# Altium project PCB_FINAL.PrjPcb
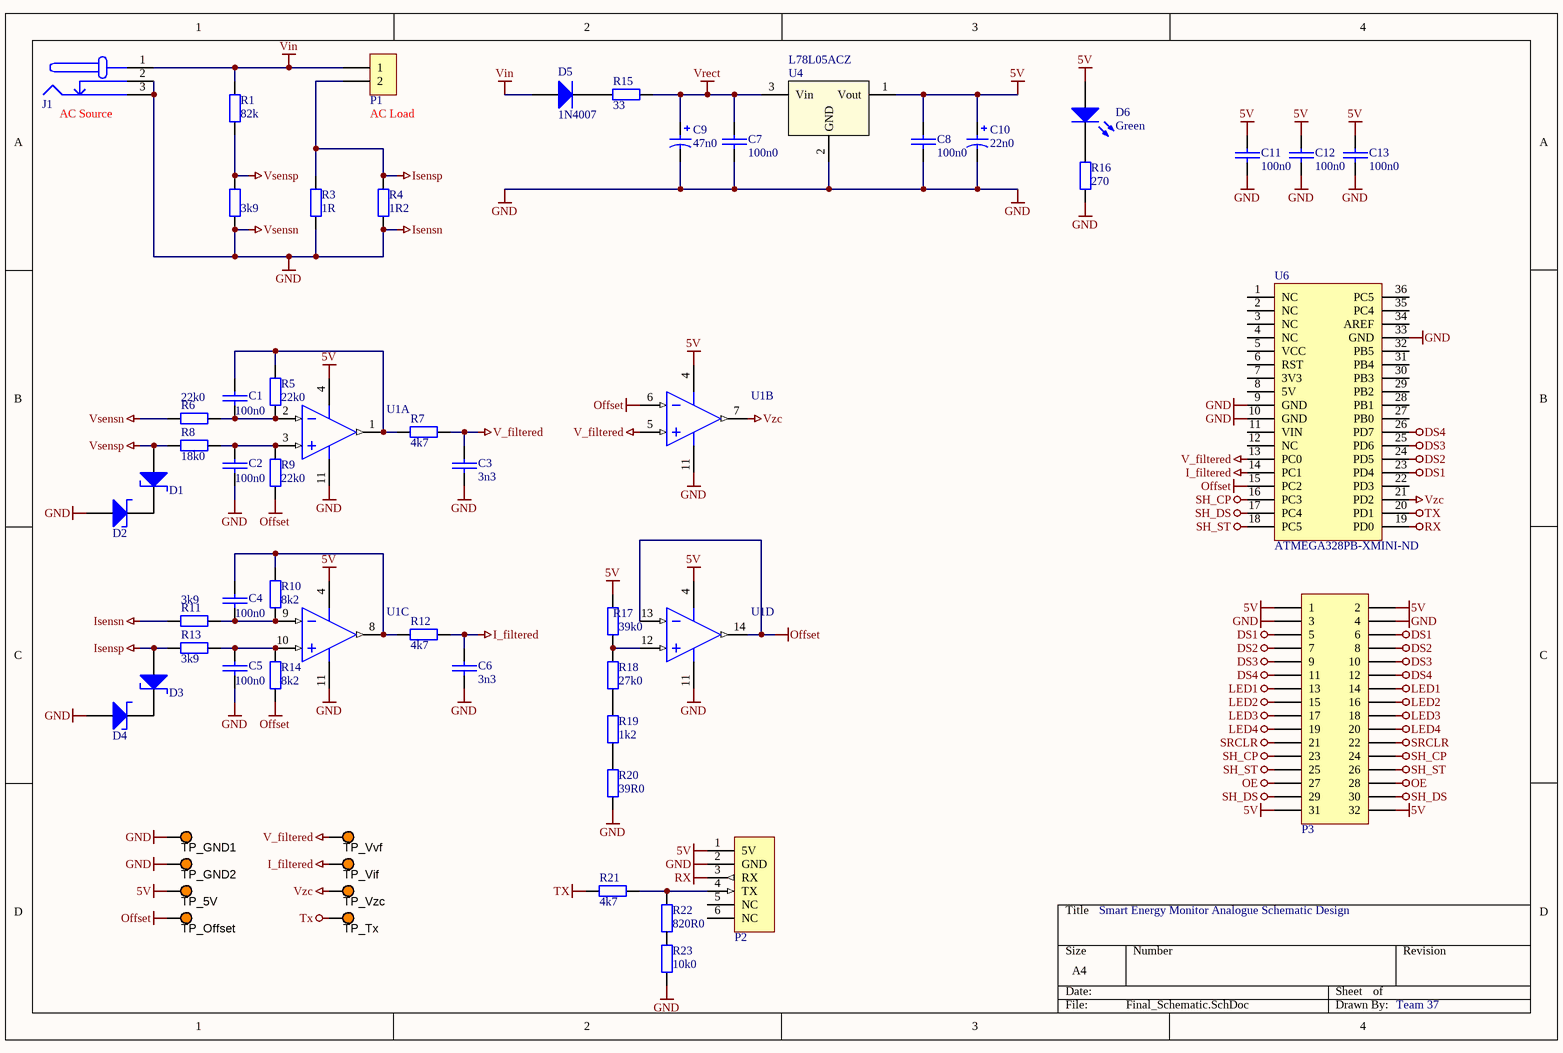
[diagram p0: Final_Schematic.SchDoc]
1 sheet, 57 parts. Net scope: global (net labels, ports and power ports of the same name join across sheets).
Board file: Team37TH.PcbDoc

## Sheet Final_Schematic.SchDoc
size A4

### Parts
?  3k9  [AXIAL-0.4]
C1  100n0  [FILM CAP-0.2]
C2  100n0  [FILM CAP-0.2]
C3  3n3  [FILM CAP-0.2]
C4  100n0  [FILM CAP-0.2]
C5  100n0  [FILM CAP-0.2]
C6  3n3  [FILM CAP-0.2]
C7  100n0  [FILM CAP-0.2]
C8  100n0  [FILM CAP-0.2]
C9  47n0  [CAP-RAD-2.5mm Pitch]
C10  22n0  [CAP-RAD-2.5mm Pitch]
C11  100n0  [FILM CAP-0.2]
C12  100n0  [FILM CAP-0.2]
C13  100n0  [FILM CAP-0.2]
D1  BZX79-CXVX  [AXIAL-Zener-0.4]  (value not drawn)
D2  BZX79-CXVX  [AXIAL-Zener-0.4]  (value not drawn)
D3  BZX79-CXVX  [AXIAL-Zener-0.4]  (value not drawn)
D4  BZX79-CXVX  [AXIAL-Zener-0.4]  (value not drawn)
D5  1N4007  [1N4007-MFG]
D6  Green  [LED]
J1  DC barrel jack  [AC-Socket]  (value not drawn)
P1  Dual Banana Plugs  [Dual Banana Plug]  (value not drawn)
P2  BLE Module Header  [HM10_HDR1X6]  (value not drawn)
P3  Display  [Display]  (value not drawn)
R1  82k  [AXIAL-0.4]
R3  1R  [AXIAL-0.4]
R4  1R2  [AXIAL-0.4]
R5  22k0  [AXIAL-0.4]
R6  22k0  [AXIAL-0.4]
R7  4k7  [AXIAL-0.4]
R8  18k0  [AXIAL-0.4]
R9  22k0  [AXIAL-0.4]
R10  8k2  [AXIAL-0.4]
R11  3k9  [AXIAL-0.4]
R12  4k7  [AXIAL-0.4]
R13  3k9  [AXIAL-0.4]
R14  8k2  [AXIAL-0.4]
R15  33  [AXIAL-0.4]
R16  270  [AXIAL-0.4]
R17  39k0  [AXIAL-0.4]
R18  27k0  [AXIAL-0.4]
R19  1k2  [AXIAL-0.4]
R20  39R0  [AXIAL-0.4]
R21  4k7  [AXIAL-0.4]
R22  820R0  [AXIAL-0.4]
R23  10k0  [AXIAL-0.4]
TP_5V  5003  [TP_TH]  (value not drawn)
TP_GND1  5003  [TP_TH]  (value not drawn)
TP_GND2  5003  [TP_TH]  (value not drawn)
TP_Offset  5003  [TP_TH]  (value not drawn)
TP_Tx  5003  [TP_TH]  (value not drawn)
TP_Vif  5003  [TP_TH]  (value not drawn)
TP_Vvf  5003  [TP_TH]  (value not drawn)
TP_Vzc  5003  [TP_TH]  (value not drawn)
U1  LM324  [DIP-14]  (value not drawn)  (parts A,B,C,D of 4)
U4  L78L05ACZ  [TO-92]
U6  Supplier Part Number 1: ATMEGA328PB-XMINI-ND  [ATmeg328P Xplained]  (hidden comment: ATmega328PB Xplained Mini Header)

### Nets
5V: C8.1 C10.1 C11.1 C12.1 C13.1 D6.1(A) P2.1(5V) P3.1 P3.2 P3.31 P3.32 R17.2 TP_5V.1 U1.4(VDD) U4.1(Vout)
DS1: P3.5 P3.6 U6.23(PD4)
DS2: P3.7 P3.8 U6.24(PD5)
DS3: P3.9 P3.10 U6.25(PD6)
DS4: P3.11 P3.12 U6.26(PD7)
GND: ?.1 C2.2 C3.2 C5.2 C6.2 C7.2 C8.2 C9.2 C10.2 C11.2 C12.2 C13.2 D2.1(A) D4.1(A) J1.2(GND_ALT) J1.3(GND) P2.2(GND) P3.3 P3.4 R3.1 R4.1 R6.1 R11.1 R16.1 R20.1 R23.1 TP_GND1.1 TP_GND2.1 U1.11(VSS) U4.2(GND) U6.9(GND) U6.10(GND) U6.33(GND)  [also labelled Isensn, Vsensn]
I_filtered: C6.1 R12.1 TP_Vif.1 U6.14(PC1)
Isensp: D3.1(A) P1.2 R3.2 R4.2 R13.1
LED1: P3.13 P3.14
LED2: P3.15 P3.16
LED3: P3.17 P3.18
LED4: P3.19 P3.20
OE: P3.27 P3.28
Offset: R9.1 R14.1 TP_Offset.1 U1.6(VINB-) U1.13(VIND-) U1.14(VOUTD) U6.15(PC2)
RX: P2.3(RX) U6.19(PD0)
SH_CP: P3.23 P3.24 U6.16(PC3)
SH_DS: P3.29 P3.30 U6.17(PC4)
SH_ST: P3.25 P3.26 U6.18(PC5)
SRCLR: P3.21 P3.22
TX: R21.1 TP_Tx.1 U6.20(PD1)
V_filtered: C3.1 R7.1 TP_Vvf.1 U1.5(VINB+) U6.13(PC0)
Vin: D5.1(A) J1.1(VCC) P1.1 R1.2
Vrect: C7.1 C9.1 R15.2 U4.3(Vin)
Vsensp: ?.2 D1.1(A) R1.1 R8.1
Vzc: TP_Vzc.1 U1.7(VOUTB) U6.21(PD2)
NetC1_1: C1.1 R5.1 R7.2 U1.1(VOUTA)
NetC1_2: C1.2 R5.2 R6.2 U1.2(VINA-)
NetC2_1: C2.1 R8.2 R9.2 U1.3(VINA+)
NetC4_1: C4.1 R10.1 R12.2 U1.8(VOUTC)
NetC4_2: C4.2 R10.2 R11.2 U1.9(VINC-)
NetC5_1: C5.1 R13.2 R14.2 U1.10(VINC+)
NetD1_2: D1.2(K) D2.2(K)
NetD3_2: D3.2(K) D4.2(K)
NetD5_2: D5.2(K) R15.1
NetD6_2: D6.2(K) R16.2
NetP2_4: P2.4(TX) R21.2 R22.2
NetR17_1: R17.1 R18.2 U1.12(VIND+)
NetR18_1: R18.1 R19.2
NetR19_1: R19.1 R20.2

Not connected (* = marked no-connect by the designer): P2 5(NC) 6(NC); R22 1; R23 2; U6 1(NC) 2(NC) 3(NC) 4(NC) 5(VCC) 6(RST) 7(3V3) 8(5V) 11(VIN) 12(NC) 22(PD3) 27(PB0) 28(PB1) 29(PB2) 30(PB3) 31(PB4) 32(PB5) 34(AREF) 35(PC4) 36(PC5)

### Notes on the sheet
- (near J1) AC Source
- (near P1) AC Load
- Smart Energy Monitor Analogue Schematic Design
- Team 37

### Library data of the parts
? = Res_TH_0AX4: Through hole resistor; Value: 39k; Published: 8-Jun-2000; LatestRevisionDate: 17-Jul-2002; LatestRevisionNote: Re-released for DXP Platform.; PackageReference: AXIAL-0.4; Publisher: Altium Limited; ComponentLink1Description: http://www.royalohm.com/pdf/product2017/PrecisionMetalMF.pdf
C1-C8 C11-C13 = FilmCap_TH_5P08: Throughhole film capacitor with 5.08mm pitch
  C1 C2 C4 C5 C7 C8: Value: 100n0
  C3 C6: Value: 3n3
  C11-C13: Value: *
C9 C10 = ElecCap_TH_2P0: Electrolytic capacitor with radial package, 2mm pitch and 5.2mm diameter; Published: 8-Jun-2000; LatestRevisionDate: 17-Jul-2002; LatestRevisionNote: Re-released for DXP Platform.; PackageReference: POLAR0.8; Publisher: Altium Limited; PackageDescription: Polarized Capacitor; 2 Leads
  C9: Value: 47n0
  C10: Value: 22n0
D1-D4 = Zener_TH_4AX0: Axial zener diode BZX79 series; Manufacturer: Nexperia USA Inc.; Manufacturer Part Number: BZX79-C4V7,143; Tolerance: ±5%; Supplier 1: Digi-Key; RoHS: RoHS Compliant; Category: Discrete Semiconductor Products; Stock 1: 8933; Pricing 1: 1=0.23, 10=0.206, 100=0.1123, 500=0.06912, 1000=0.04714 (NZD); Packaging: Cut Tape (CT); Part Status: Active; Operating Temperature: -65°C ~ 200°C; Mounting Type: Through Hole; Package / Case: DO-204AH, DO-35, Axial; Supplier Device Package: DO-35; ComponentLink1URL: https://assets.nexperia.com/documents/data-sheet/BZX79.pdf; ComponentLink1Description: https://assets.nexperia.com/documents/data-sheet/BZX79.pdf; Supplier Part Number 1: 1727-1864-1-ND
D5 = 1N4007_TH_4AX0: 1N4007 1000V standard axial diode; ComponentLink1URL: https://www.fairchildsemi.com/datasheets/1N/1N914.pdf; ComponentLink1Description: https://www.fairchildsemi.com/datasheets/1N/1N914.pdf; Supplier 1: Digi-Key; Supplier Part Number 1: 1N4007RLGOSCT-ND
D6 = LED_TH_2P54: Typical throughole GaAs LED with 2.54mm pitch; Manufacturer: Generic Components; Class I: Optoelectronic; Published: 8-Jun-2000; Revision: July-2002: Re-released for DXP Platform.; Publisher: Altium Limited; Class II: LED; Value: Green
J1 = AC_Input: DC barrel jack connection to AC source; Value: socket
P1 = AC_Output: Dual banana plugs connection to the AC load; LatestRevisionDate: 17-Jul-2002; LatestRevisionNote: Re-released for DXP Platform.; Publisher: Altium Limited
P2 = BLEModule_TH: 2.54mm pitch 6-pin header for BLE module; LatestRevisionDate: 17-Jul-2002; LatestRevisionNote: Re-released for DXP Platform.; Publisher: Altium Limited
P3 = Display: 16-Pin Header Connecting Display
R1 = Res_TH_0AX4: Through hole resistor; Value: 820k; Published: 8-Jun-2000; LatestRevisionDate: 17-Jul-2002; LatestRevisionNote: Re-released for DXP Platform.; PackageReference: AXIAL-0.4; Publisher: Altium Limited; ComponentLink1Description: http://www.royalohm.com/pdf/product2017/PrecisionMetalMF.pdf
R3 R4 R7 R8 R10-R23 = Res_TH_0AX4: Through hole resistor; Published: 8-Jun-2000; LatestRevisionDate: 17-Jul-2002; LatestRevisionNote: Re-released for DXP Platform.; PackageReference: AXIAL-0.4; Publisher: Altium Limited; ComponentLink1Description: http://www.royalohm.com/pdf/product2017/PrecisionMetalMF.pdf
  R3: Value: 1R
  R4: Value: 1R2
  R7 R12: Value: 4k7
  R8: Value: 18k0
  R10 R14: Value: 8k2
  R11 R13: Value: 3k9
  R15 R16 R21-R23: Value: *
  R17: Value: 39k0
  R18: Value: 27k0
  R19: Value: 1k2
  R20: Value: 39R0
R5 R6 R9 = Res_TH_0AX4: Through hole resistor; Value: 56k0; Published: 8-Jun-2000; LatestRevisionDate: 17-Jul-2002; LatestRevisionNote: Re-released for DXP Platform.; PackageReference: AXIAL-0.4; Publisher: Altium Limited; ComponentLink1Description: http://www.royalohm.com/pdf/product2017/PrecisionMetalMF.pdf
TP_5V TP_GND1 TP_GND2 TP_Offset TP_Tx TP_Vif TP_Vvf TP_Vzc = TestPoint: Test Point, Orange, 1-Pin THD, RoHS; Peak Reverse Current: 600 uA; Forward Current: 3 A; Max Surge Current: 80 A; Forward Voltage: 1.08 V; Max Operating Temperature: 150 degC; PackageReference: 5003; Pins: 2; ComponentLink2URL: http://keyelco.com/userAssets/file/M65p56.pdf; PackageDescription: 1-Pin Through Hole Device, Dia 2.54 mm; Weight: 0.01 lb; Diameter: 5.3 mm; Mount: Through Hole; Package Quantity: 500; Packaging: Bulk; Min Operating Temperature: -65 degC; ComponentLink1Description: Manufacturer URL; Height: 0.25 inch; ComponentLink1URL: http://www.keyelco.com/; ComponentLink2Description: Datasheet; Width: 0.25 inch; REACH SVHC: No SVHC; RoHSCompliant: true; Radiation Hardening: No; Length: 9.5 mm; DatasheetVersion: Jun-15
U1 = LM324N_TH_DIP16: IC OPAMP GP 14DIP; Manufacturer: ON Semiconductor; Manufacturer Part Number: LM324N; Amplifier Type: General Purpose; Current - Supply: 1mA; Voltage - Supply, Single/Dual (±): 3 V ~ 32 V, ±1.5 V ~ 16 V; Supplier 1: Digi-Key; RoHS: RoHS Compliant; Category: Integrated Circuits (ICs); Stock 1: 2900; Pricing 1: 1=0.9, 10=0.775, 100=0.5789, 500=0.45482, 1000=0.35145 (NZD); Packaging: Tube; Part Status: Active; Output Type: -; Slew Rate: -; Operating Temperature: 0°C ~ 70°C; Mounting Type: Through Hole; Package / Case: 14-DIP (0.300", 7.62mm); Supplier Device Package: 14-DIP; Base Part Number: LM324; ComponentLink1URL: https://www.fairchildsemi.com/datasheets/LM/LM2902.pdf; ComponentLink1Description: https://www.fairchildsemi.com/datasheets/LM/LM2902.pdf; Supplier Part Number 1: LM324NFS-ND
U4 = L78L05_TH_TO92: Voltage Regulator 5V; Manufacturer: ON Semiconductor; Manufacturer Part Number: LM78L05ACZX; Output Configuration: Positive; Output Type: Fixed; Voltage - Input (Max): 30V; Current - Output: 100mA; PSRR: 80dB (120Hz); Protection Features: Over Temperature, Short Circuit; Supplier 1: Digi-Key; RoHS: RoHS Compliant; Category: Integrated Circuits (ICs); Stock 1: 7782; Pricing 1: 1=0.69, 10=0.517, 100=0.3226, 500=0.2207, 1000=0.16976 (NZD); Packaging: Cut Tape (CT); Part Status: Active; Voltage - Output (Min/Fixed): 5V; Voltage - Output (Max): -; Voltage Dropout (Max): -; Control Features: -; Operating Temperature: -40°C ~ 125°C; Mounting Type: Through Hole; Package / Case: TO-226-3, TO-92-3 (TO-226AA) (Formed Leads); Supplier Device Package: TO-92-3; Base Part Number: LM78L05; ComponentLink1URL: https://www.fairchildsemi.com/datasheets/MC/MC78L05A.pdf; ComponentLink1Description: https://www.fairchildsemi.com/datasheets/MC/MC78L05A.pdf; Supplier Part Number 1: LM78L05ACZXCT-ND
U6 = ATmega328PBXplained_TH: Dual 18-pin headers connecting to ATmega328PB Xplained Mini; Manufacturer: Microchip Technology; Manufacturer Part Number: ATMEGA328PB-XMINI; Board Type: Evaluation Platform; Core Processor: AVR; Platform: ATmega328P Xplained Mini; Contents: Board(s); Supplier 1: Digi-Key; RoHS: RoHS Compliant; Category: Development Boards, Kits, Programmers; Stock 1: 454; Pricing 1: 1=15.11 (NZD); Part Status: Active; Type: MCU 8-Bit; Operating System: -; For Use With/Related Products: ATmega328P; Mounting Type: Fixed; ComponentLink1URL: http://www.microchip.com/mymicrochip/filehandler.aspx?ddocname=en589665; ComponentLink1Description: http://www.microchip.com/mymicrochip/filehandler.aspx?ddocname=en589665